# Altium schematic sheet 集成板lite.SchDoc
size A4; SheetNumber: 1; SheetTotal: 1
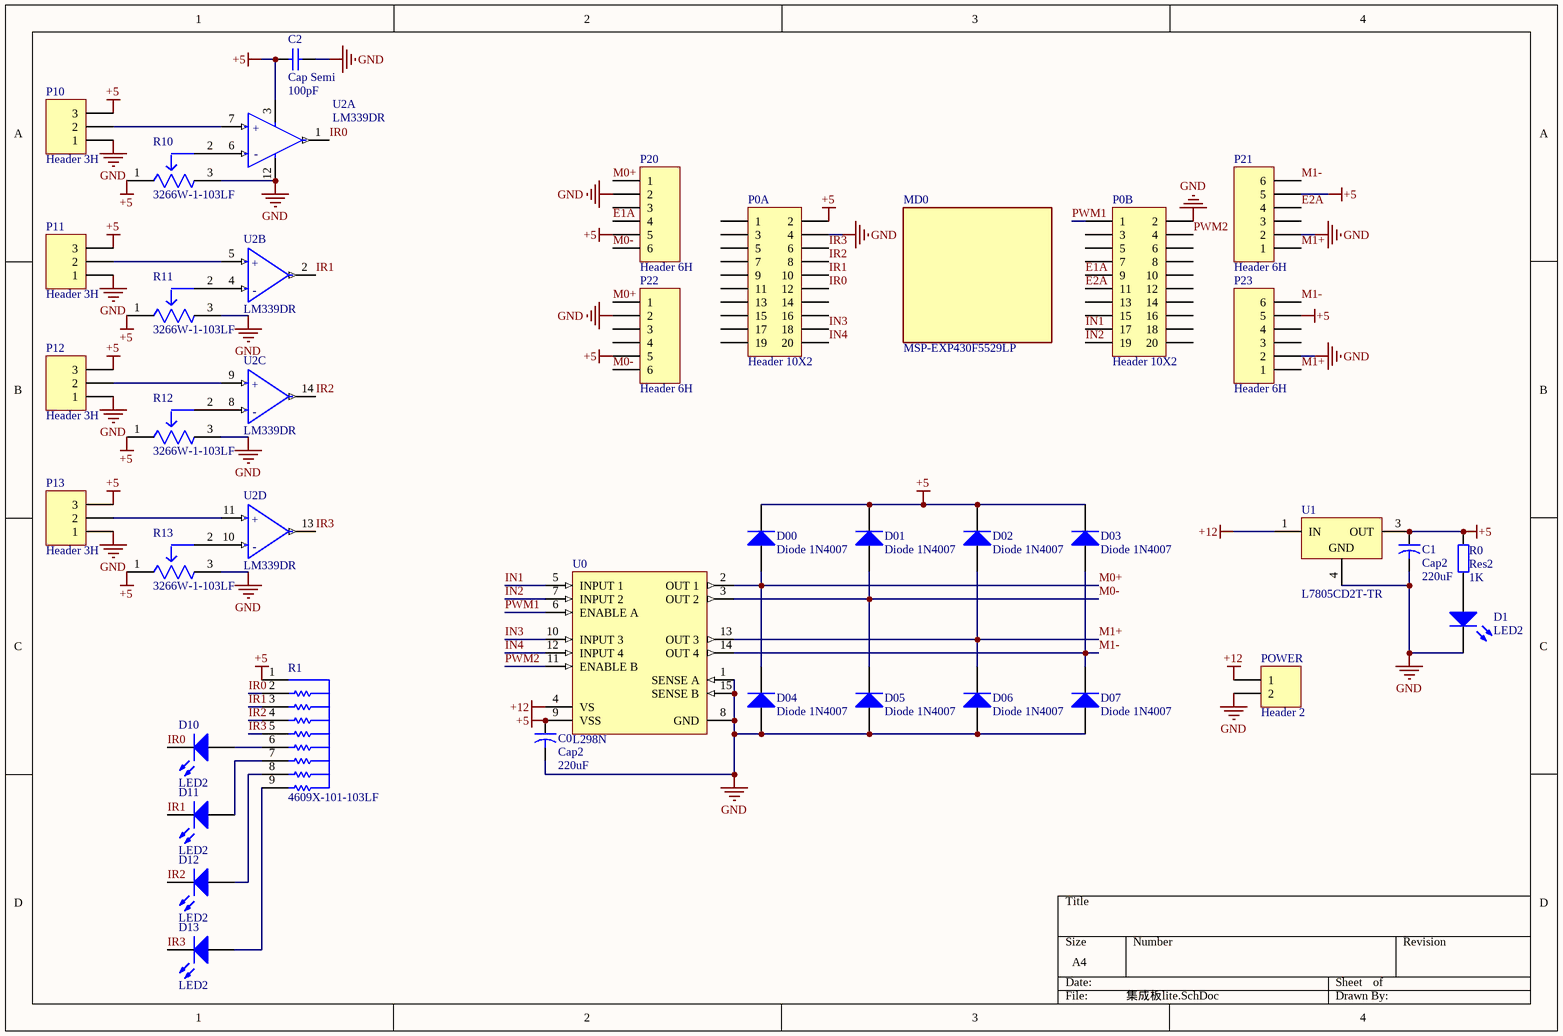
[diagram p0: 集成板lite.SchDoc]

## Parts
C0  Cap2  value 220uF  [CAPR5-4X5]
C1  Cap2  value 220uF  [CAPR5-4X5]
C2  Cap Semi  value 100pF  [C1206]
D00  Diode 1N4007  [DO-41]
D1  LED2  [3.2X1.6X1.1]
D01  Diode 1N4007  [DO-41]
D02  Diode 1N4007  [DO-41]
D03  Diode 1N4007  [DO-41]
D04  Diode 1N4007  [DO-41]
D05  Diode 1N4007  [DO-41]
D06  Diode 1N4007  [DO-41]
D07  Diode 1N4007  [DO-41]
D10  LED2  [3.2X1.6X1.1]
D11  LED2  [3.2X1.6X1.1]
D12  LED2  [3.2X1.6X1.1]
D13  LED2  [3.2X1.6X1.1]
MD0  MSP-EXP430F5529LP  [FP-MSP-EXP430F5529LP-MFG]
P0A  Header 10X2  [HDR2X10]
P0B  Header 10X2  [HDR2X10]
P10  Header 3H  [HDR1X3H]
P11  Header 3H  [HDR1X3H]
P12  Header 3H  [HDR1X3H]
P13  Header 3H  [HDR1X3H]
P20  Header 6H  [HDR1X6H]
P21  Header 6H  [HDR1X6H]
P22  Header 6H  [HDR1X6H]
P23  Header 6H  [HDR1X6H]
POWER  Header 2  [TX60-LI-P]
R0  Res2  value 1K  [C1206]
R1  4609X-101-103LF  [BOUR-4609X]
R10  3266W-1-103LF  [FP-3266W-MFG]
R11  3266W-1-103LF  [FP-3266W-MFG]
R12  3266W-1-103LF  [FP-3266W-MFG]
R13  3266W-1-103LF  [FP-3266W-MFG]
U0  L298N  [STM-FM-15]
U1  L7805CD2T-TR  [TO-263_M]
U2  LM339DR  [FP-D0014A-MFG]  (parts A,B,C,D of 4)

## Nets
+5: C0.1 C1.1 C2.1 D00.2(K) D01.2(K) D02.2(K) D03.2(K) P0A.2 P10.3 P11.3 P12.3 P13.3 P20.5 P21.5 P22.5 P23.5 R0.2 R1.1 R10.1(CCW) R11.1(CCW) R12.1(CCW) R13.1(CCW) U0.9(VSS) U1.3(OUT) U2.3(VCC)
+12: POWER.1 U0.4(VS) U1.1(IN)
GND: C0.2 C1.2 C2.2 D1.2(K) D04.1(A) D05.1(A) D06.1(A) D07.1(A) P0A.4 P0B.2 P10.1 P11.1 P12.1 P13.1 P20.2 P21.2 P22.2 P23.2 POWER.2 R10.3(CW) R11.3(CW) R12.3(CW) R13.3(CW) U0.1(SENSE_A) U0.8(GND) U0.15(SENSE_B) U1.4(GND) U2.12(GND)
E1A: P0B.9 P20.4
E2A: P0B.11 P21.4
IN1: P0B.17 U0.5(INPUT_1)
IN2: P0B.19 U0.7(INPUT_2)
IN3: P0A.18 U0.10(INPUT_3)
IN4: P0A.20 U0.12(INPUT_4)
IR0: D10.2(K) P0A.12 R1.2 U2.1(1OUT)
IR1: D11.2(K) P0A.10 R1.3 U2.2(2OUT)
IR2: D12.2(K) P0A.8 R1.4 U2.14(OUT3)
IR3: D13.2(K) P0A.6 R1.5 U2.13(OUT4)
M0+: D00.1(A) D04.2(K) P20.1 P22.1 U0.2(OUT_1)
M0-: D01.1(A) D05.2(K) P20.6 P22.6 U0.3(OUT_2)
M1+: D02.1(A) D06.2(K) P21.1 P23.1 U0.13(OUT_3)
M1-: D03.1(A) D07.2(K) P21.6 P23.6 U0.14(OUT_4)
PWM1: P0B.1 U0.6(ENABLE_A)
PWM2: P0B.4 U0.11(ENABLE_B)
NetD1_1: D1.1(A) R0.1
NetD10_1: D10.1(A) R1.6
NetD11_1: D11.1(A) R1.7
NetD12_1: D12.1(A) R1.8
NetD13_1: D13.1(A) R1.9
NetP10_2: P10.2 U2.7(1IN+)
NetP11_2: P11.2 U2.5(2IN+)
NetP12_2: P12.2 U2.9(3IN+)
NetP13_2: P13.2 U2.11(4IN+)
NetR10_2: R10.2(WIPER) U2.6(1IN-)
NetR11_2: R11.2(WIPER) U2.4(2IN-)
NetR12_2: R12.2(WIPER) U2.8(3IN-)
NetR13_2: R13.2(WIPER) U2.10(4IN-)

Not connected (* = marked no-connect by the designer): P0A 1 3 5 7 9 11 13 14 15 16 17 19; P0B 3 5 6 7 8 10 12 13 14 15 16 18 20; P20 3; P21 3; P22 3 4; P23 3 4

## Notes on the sheet
- (in symbol CMP-04896-000028-1, part A) +; -
- (in symbol CMP-04896-000028-1, part B) +; -
- (in symbol CMP-04896-000028-1, part C) +; -
- (in symbol CMP-04896-000028-1, part D) +; -

## Library data of the parts
C0 C1 = Cap2: Capacitor; Published: 23-Sep-2002; PackageReference: CAPR5-4X5; Publisher: Altium Limited; PackageDescription: Capacitor; 2 Leads
C2 = Cap Semi: Capacitor (Semiconductor SIM Model); Published: 8-Jun-2000; LatestRevisionDate: 29-May-2009; LatestRevisionNote: IPC-7351 Footprint Added.; PackageReference: C1206; Publisher: Altium Limited; PackageDescription: Chip Capacitor
D00 D01 D02 D03 D04 D05 D06 D07 = Diode 1N4007: 1 Amp General Purpose Rectifier; Published: 8-Jun-2000; LatestRevisionDate: 17-Jul-2002; LatestRevisionNote: Re-released for DXP Platform.; DatasheetVersion: 1998; PackageVersion: Aug-1999; PackageReference: DO-41; Publisher: Altium Limited; PackageDescription: Diode, Axial; Body 5.2 x 2.7 mm (LxDia. max), Lead Dia. 0.86 mm (max); Code_JEDEC: DO-204-AL; ComponentLink1Description: Manufacturer Link; ComponentLink1URL: http://www.fairchildsemi.com/; ComponentLink2Description: Datasheet; ComponentLink2URL: http://www.fairchildsemi.com/ds/1N%2F1N4001.pdf
D1 D10-D13 = LED2: Typical RED, GREEN, YELLOW, AMBER GaAs LED; Published: 8-Jun-2000; LatestRevisionDate: 17-Jul-2002; LatestRevisionNote: Re-released for DXP Platform.; PackageVersion: Feb-2002; PackageReference: 3.2X1.6X1.1; Publisher: Altium Limited; PackageDescription: SM LED; 2 Flat Leads
MD0 = CMP-04865-000002-1: LAUNCHPAD MSP430F5529 EVAL BRD; Manufacturer: Texas Instruments; Max Supply Voltage: 5V; Memory Size: 128KBytes; Memory Type: FLASH; Number Of I/Os: 35; Frequency: 25MHz; Min Supply Voltage: 3.3V; Digikey Description: LAUNCHPAD MSP430F5529 EVAL BRD; Package: 0; Device Class L1: Integrated Circuits (ICs); Device Class L3: unset; ComponentLink2URL: http://www.ti.com/lit/ug/slau533d/slau533d.pdf; Mouser Description: Development Boards & Kits - MSP430 MSP-EXP430F5529LP; Automotive: No; Manufacturer Part Number: MSP-EXP430F5529LP; Octopart: https://octopart.com/msp-exp430f5529lp-texas+instruments-30356695; Category: UNK; ComponentLink2Description: Datasheet; Lead Free: Yes; Device Class L2: Embedded Processors and Controllers
P0A P0B = Header 10X2: Header, 10-Pin, Dual row; LatestRevisionDate: 17-Jul-2002; LatestRevisionNote: Re-released for DXP Platform.; Publisher: Altium Limited
P10-P13 = Header 3H: Header, 3-Pin, Right Angle; LatestRevisionDate: 17-Jul-2002; LatestRevisionNote: Re-released for DXP Platform.; Publisher: Altium Limited
P20-P23 = Header 6H: Header, 6-Pin, Right Angle; LatestRevisionDate: 17-Jul-2002; LatestRevisionNote: Re-released for DXP Platform.; Publisher: Altium Limited
POWER = Header 2: Header, 2-Pin; LatestRevisionDate: 17-Jul-2002; LatestRevisionNote: Re-released for DXP Platform.; Publisher: Altium Limited
R0 = Res2: Resistor; Published: 8-Jun-2000; LatestRevisionDate: 17-Jul-2002; LatestRevisionNote: Re-released for DXP Platform.; PackageReference: AXIAL-0.4; Publisher: Altium Limited; PackageDescription: Axial Device, Thru-Hole; 2 Leads; 0.4 in Pin Spacing
R1 = CMP-2000-05605-1: Resistor, Network, 1.13 W, 10 kOhm, -55 to 125 degC, 9-Pin THD, RoHS, Bulk; Manufacturer: Bourns; Tolerance: ±2%; Power, Rating: 1.13W; Resistance: 10kilohms; Temperature, Operating: -55to+125°C; Brand/Series: 4600XSeries; Circuit: BussedArray; Number of Resistors: 8; Package Type: SIP; Dimensions: 0.898x0.098x0.2(22.81x2.49x5.08)LxWxHin.(mm); Package Reference: 4609X; Mounting Technology: ThroughHole; Package Description: 9-Pin Through Hole Device, Body 22.81 x 2.49 mm, Pitch 2.54 mm; Number of Terminals: 9; Datasheet URL: https://datasheet.ciiva.com/11807/0900766b8069ccfd-11807021.pdf; Datasheet Version: 04/2010; Manufacturer URL: http://www.bourns.com/; Mounting Type: ThroughHole
R10-R13 = CMP-07234-000016-1: TRIMMER 10K OHM 0.25W PC PIN TOP; Manufacturer: Bourns; Temperature Coefficient: 100ppm/°C; Tolerance: 10%; Value: 10kΩ; Standoff Height: 0.43mm; Device Class L3: Variable Resistors and Potentiometers; ComponentLink2URL: https://www.bourns.com/docs/Product-Datasheets/3266.pdf; ComponentLink2Description: Datasheet; Device Class L2: Resistors; Power Rating: 0.25W; Mouser Description: Trimmer Resistors - Through Hole 1/4 10Kohms 10% SQ W/Standoff Sealed; Category: Res; Digikey Description: TRIMMER 10K OHM 0.25W PC PIN TOP; Device Class L1: Passive Components; Octopart: https://octopart.com/3266w-1-103lf-bourns-81445; Height: 9.02mm; Temperature Range High: +125°C; Series: 3266; Temperature Range Low: -55°C; Composition: Cermet; Manufacturer Part Number: 3266W-1-103LF; Resistance: 10kΩ; Lead Free: Yes; RoHS: TRUE; Automotive: No; Package: 3266W; Temperature: -55°C to +125°C
U0 = CMP-2000-06526-1: Dual Full-Bridge Driver, 4.8 to 46 V, -40 to 150 degC, 15-Pin FM (MW 15L), RoHS, Tube; Manufacturer: STMicroelectronics; PartNumber: L298; Output Current: 2A; Supply Voltage Max: 7V; Driver Case Style: Multiwatt; Supply Voltage Min: 4.5V; No. of Pins: 15Pins; SVHC: NoSVHC(17-Dec-2015); Output Voltage: 46V; No. of Outputs: 4Outputs; Motor Type: FullBridge; MSL: -; Package Description: 15-Pin Flange Mount, Body 5 x 19.6 mm, Pitch 1.27 mm; Datasheet Version: 01/2000; Package Reference: FM-15; Mounting Technology: ThroughHole; Packaging: Each; Automotive Qualification Standard: -; Product Range: -; Datasheet URL: https://datasheet.ciiva.com/15109/getdatasheetpartid-50682-15109332.pdf; Operating Temperature Max: 130°C; Operating Temperature Min: -25°C; Manufacturer URL: http://www.st.com/
U1 = CMP-0244-00213-1: Positive Voltage Regulator, 3-Pin D2PAK, Tape and Reel; PackageReference: TO-263; ComponentLink2URL: http://www.st.com/internet/com/TECHNICAL_RESOURCES/TECHNICAL_LITERATURE/DATASHEET/CD00000444.pdf; PackageDescription: 3-Pin Transistor Outline Package 2.54 mm Pitch, 15.4 mm Lead Span (D2PAK); DatasheetVersion: 16/11/2011; ComponentLink2Description: Datasheet; ComponentLink1Description: Manufacturer URL; PackageVersion: 2011; ComponentLink1URL: http://www.st.com
U2 = CMP-04896-000028-1: IC QUAD DIFF COMP 14-SOIC; Manufacturer: Texas Instruments; Nominal Supply Current: 0.8mA; Min Dual Supply Voltage: 1V; Number Of Channels: 4; Input Offset Voltage: 2mV; Max Junction Temp: +70°C; Min Supply Voltage: 2V; Response Time: 1.3us; Max Dual Supply Voltage: 18V; Max Supply Voltage: 30V; Standoff Height: 0.1mm; Input Bias Current: -0.025uA; Output Current Per Channel: 6mA; Category: IC; Octopart: https://octopart.com/lm339dr-texas+instruments-45532; Automotive: No; Temperature: 0°C to +70°C; Ipc Land Pattern Name: SOIC127P600X175-14; Temperature Range Low: 0°C; Mouser Description: Analog Comparators Quad Differential; Lead Free: Yes; Digikey Description: IC QUAD DIFF COMP 14-SOIC; ComponentLink2URL: http://www.ti.com/lit/ds/symlink/lm339.pdf; Device Class L3: Comparators; Manufacturer Part Number: LM339DR; Temperature Range High: +70°C; Device Class L2: Linear ICs; Height: 1.75mm; Device Class L1: Integrated Circuits (ICs); Package: D0014A; RoHS: TRUE; ComponentLink2Description: Datasheet